# EAGLE design LPC_ERT_30_Thermostat_Adapter_smd1206 (EAGLE 5.07)
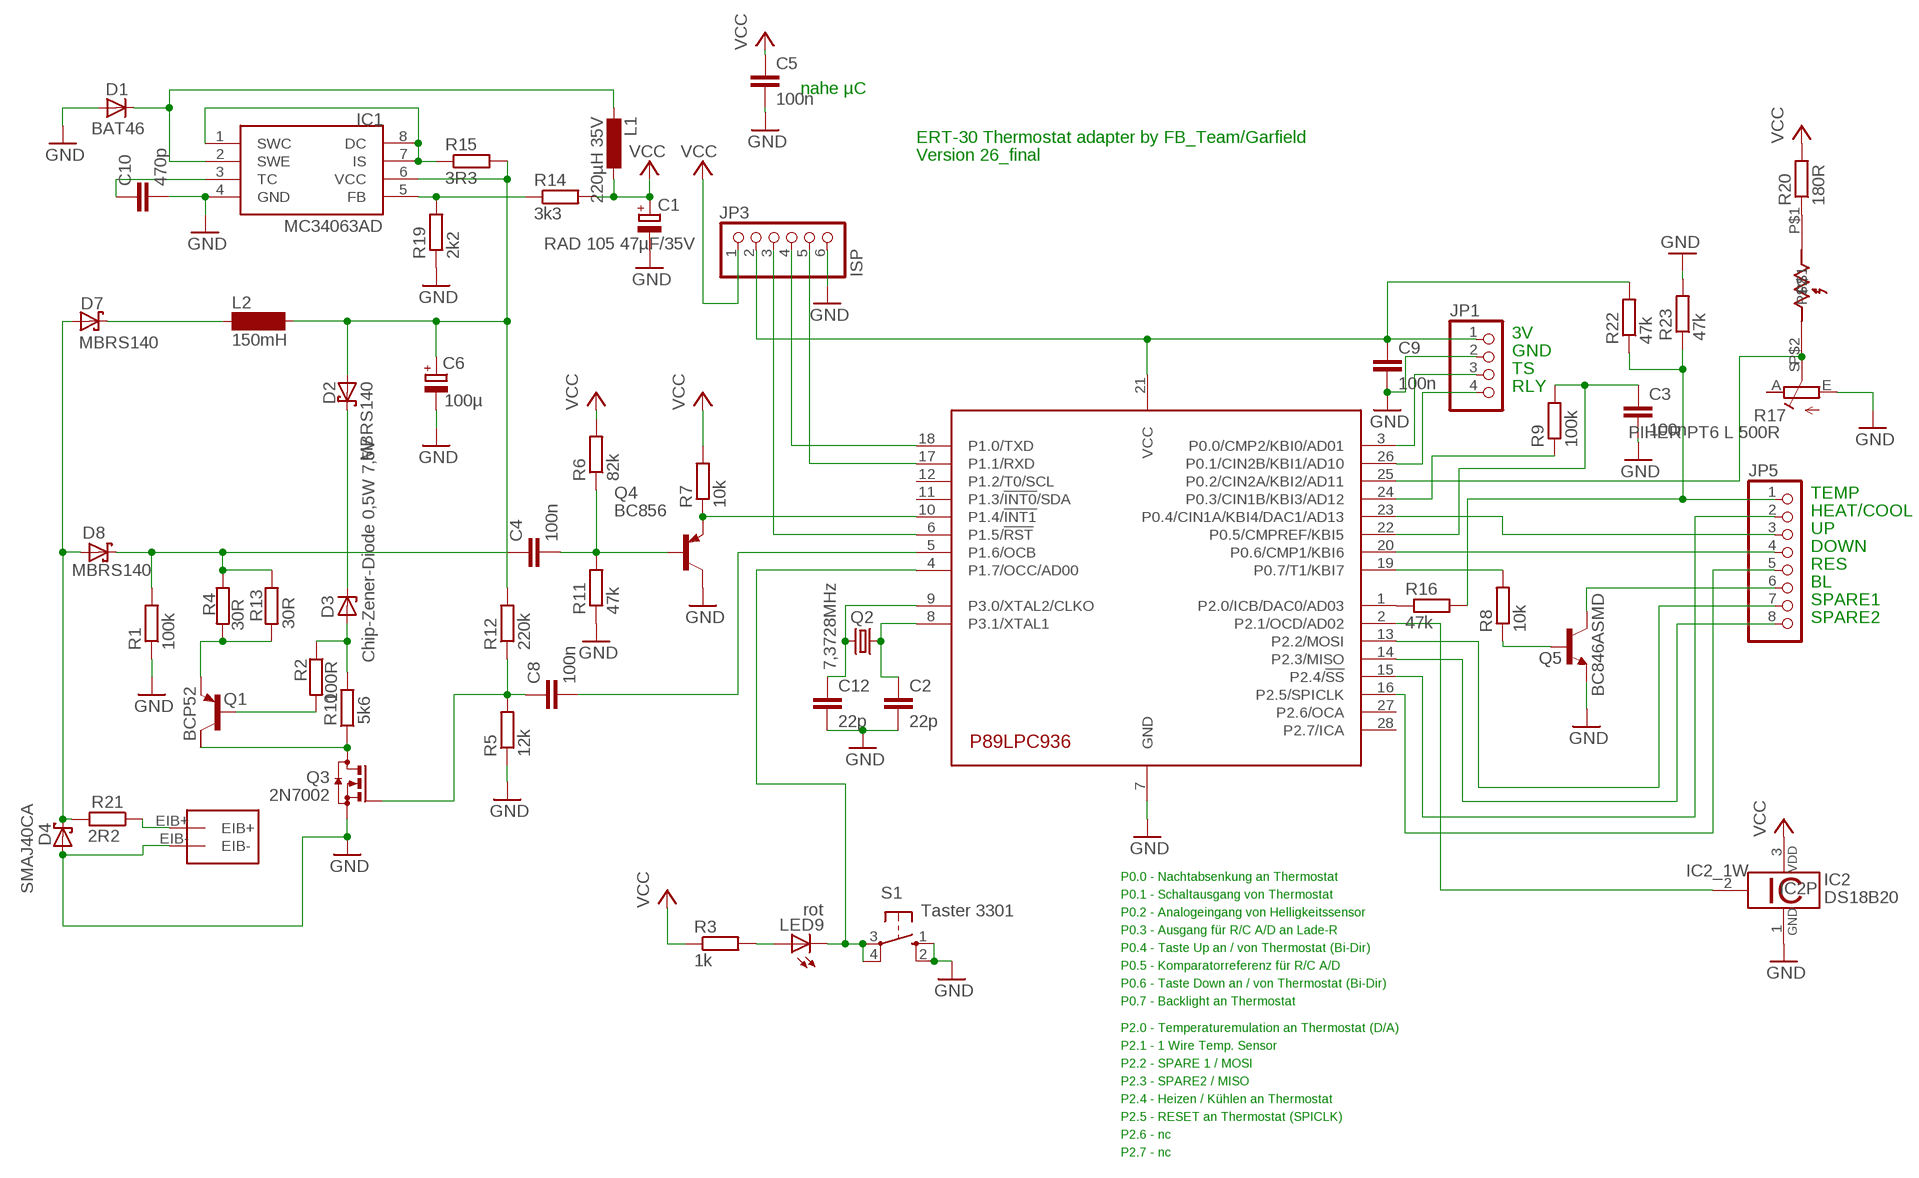
[diagram p0: schematic, sheet 1]

## Parts
C1  RAD 105 47µF/35V  CPOL-EUE2-5  [E2-5]
C2  22p  C-EUC1206  [C1206]
C3  100n  C-EUC1206  [C1206]
C4  100n  C-EUC1206  [C1206]
C5  100n  C-EUC1206  [C1206]
C6  100µ  CPOL-EUE2.5-7  [E2,5-7]
C8  100n  C-EUC1206  [C1206]
C9  100n  C-EUC1206  [C1206]
C10  470p  C-EUC1206  [C1206]
C12  22p  C-EUC1206  [C1206]
D1  BAT46  DIODE-MINIMELF  [MINIMELF]
D2  MBRS140  MBRS130LT3  [SMB]
D3  Chip-Zener-Diode 0,5W 7,5V  ZPD  [MINIMELF]
D4  SMAJ40CA  MBRS130LT3  [SMB]
D7  MBRS140  MBRS130LT3  [SMB]
D8  MBRS140  MBRS130LT3  [SMB]
IC1  MC34063AD  [SOIC8]
IC2  DS18B20  [TO92-]
JP1  PINHD-1X4  [1X04]
JP3  ISP  PINHD-1X6  [1X06]
JP5  PINHD-1X8  [1X08]
L1  220µH 35V  L-EU2200-11.43  [2200-11.43]
L2  150mH  SD12-1000  [SD12_1000]
LDR  LDR07  [LDR07]
LED9  rot  LEDCHIPLED_1206  [CHIPLED_1206]
Q1  BCP52  FZT753SMD  [SOT223]
Q2  7,3728MHz  CRYSTALHC49UP  [HC49UP]
Q3  2N7002  BSS123  [SOT23]
Q4  BC856  BC856ALT1SMD  [SOT23-BEC]
Q5  BC846ASMD  [SOT23]
R1  100k  R-EU_R1206  [R1206]
R2  100R  R-EU_R1206  [R1206]
R3  1k  R-EU_R1206  [R1206]
R4  30R  R-EU_R1206  [R1206]
R5  12k  R-EU_R1206  [R1206]
R6  82k  R-EU_R1206  [R1206]
R7  10k  R-EU_R1206  [R1206]
R8  10k  R-EU_R1206  [R1206]
R9  100k  R-EU_R1206  [R1206]
R10  5k6  R-EU_R1206  [R1206]
R11  47k  R-EU_R1206  [R1206]
R12  220k  R-EU_R1206  [R1206]
R13  30R  R-EU_R1206  [R1206]
R14  3k3  R-EU_R1206  [R1206]
R15  3R3  R-EU_R1206  [R1206]
R16  47k  R-EU_R1206  [R1206]
R17  PIHER PT6 L 500R  R-TRIMM-PT6L  [PT6L]
R19  2k2  R-EU_R1206  [R1206]
R20  180R  R-EU_R1206  [R1206]
R21  2R2  R-EU_R1206  [R1206]
R22  47k  R-EU_R1206  [R1206]
R23  47k  R-EU_R1206  [R1206]
S1  Taster 3301  10-XX  [B3F-10XX]
U$1  P89LPC936  P89LPC936_SMDPLCC28S  [PLCC28S]
U$5  EIB-CON  [EIB-CON]

## Nets
GND [supply]: C1.- C2.2 C3.2 C5.2 C6.- C9.2 C10.2 C12.2 D1.A D4.A IC1.4(GND) IC2.1 JP1.2 JP3.6 Q3.2(S) Q4.C Q5.2(E) R1.1 R5.1 R11.1 R17.E R19.1 R23.2 S1.1(S) S1.2(S1) U$1.7(GND) U$5.EIB-
N$1: Q4.E R7.1 U$1.10(P1.4/!INT1)
N$2: C4.2 Q4.B R6.1 R11.2
N$3: IC1.5(FB) R14.1 R19.2
N$4: IC1.1(SWC) IC1.7(IS) IC1.8(DC) R15.1
N$5: C8.2 U$1.5(P1.6/OCB)
N$6: Q1.2(C) Q3.3(D) R10.1
N$7 [supply]: C6.+ D2.A IC1.6(VCC) L2.2 R12.2 R15.2
N$8 [supply]: D7.C L2.1
N$9 [supply]: C4.1 D8.C R1.2 R4.1 R13.1
N$10: D1.C IC1.2(SWE) L1.2
N$11: D3.A R2.1 R10.2
N$12: Q1.3(E) R4.2 R13.2
N$13: C10.1 IC1.3(TC)
N$14: Q1.1(B) R2.2
N$15: C2.1 Q2.1 U$1.8(P3.1/XTAL1)
N$16 [supply]: D4.C D7.A D8.A R21.2
N$17: LED9.C S1.3(P) S1.4(P1) U$1.4(P1.7/OCC/AD00)
N$18: C12.1 Q2.2 U$1.9(P3.0/XTAL2/CLKO)
N$19: JP5.3 U$1.23(P0.4/CIN1A/KBI4/DAC1/AD13)
N$20: Q5.1(B) R8.1
N$21: R8.2 U$1.19(P0.7/T1/KBI7)
N$22: JP1.3 U$1.3(P0.0/CMP2/KBI0/AD01)
N$23: JP1.4 U$1.26(P0.1/CIN2B/KBI1/AD10)
N$24: JP5.6 Q5.3(C)
N$25: JP5.5 U$1.16(P2.5/SPICLK)
N$26: C3.1 R9.2 U$1.22(P0.5/CMPREF/KBI5)
N$27: JP5.2 U$1.15(P2.4/!SS)
N$29: JP3.4 U$1.18(P1.0/TXD)
N$30: JP3.5 U$1.17(P1.1/RXD)
N$31: JP3.3 U$1.6(P1.5/!RST)
N$32: LDR.P$1 R20.1
N$34: C8.1 Q3.1(G) R5.2 R12.1
N$35: C9.1 JP1.1 JP3.2 R22.2 U$1.21(VCC)
N$36: IC2.2 U$1.2(P2.1/OCD/AD02)
N$37: LDR.P$2 R17.S U$1.25(P0.2/CIN2A/KBI2/AD11)
N$38: JP5.7 U$1.13(P2.2/MOSI)
N$39: R21.1 U$5.EIB+
N$40: D2.C D3.C
N$41: LED9.A R3.2
N$44: JP5.8 U$1.14(P2.3/MISO)
N$46: JP5.1 R16.2 R22.1 R23.1
N$47: R16.1 U$1.1(P2.0/ICB/DAC0/AD03)
N$50: R9.1 U$1.24(P0.3/CIN1B/KBI3/AD12)
N$51: JP5.4 U$1.20(P0.6/CMP1/KBI6)
VCC [supply]: C1.+ C5.1 IC2.3 JP3.1 L1.1 R3.1 R6.2 R7.2 R14.2 R20.2
Unconnected: Q1.4(C/) R17.A U$1.11(P1.3/!INT0!/SDA) U$1.12(P1.2/T0/SCL) U$1.27(P2.6/OCA) U$1.28(P2.7/ICA)

## Notes on the sheet
- nahe µC
- ERT-30 Thermostat adapter by FB_Team/Garfield
- Version 26_final
- 3V
- GND
- TS
- RLY
- TEMP
- HEAT/COOL
- UP
- DOWN
- RES
- BL
- SPARE1
- SPARE2
- P0.0 - Nachtabsenkung an Thermostat
- P0.1 - Schaltausgang von Thermostat
- P0.2 - Analogeingang von Helligkeitssensor
- P0.3 - Ausgang für R/C A/D an Lade-R
- P0.4 - Taste Up an / von Thermostat (Bi-Dir)
- P0.5 - Komparatorreferenz für R/C A/D
- P0.6 - Taste Down an / von Thermostat (Bi-Dir)
- P0.7 - Backlight an Thermostat
- P2.0 - Temperaturemulation an Thermostat (D/A)
- P2.1 - 1 Wire Temp. Sensor
- P2.2 - SPARE 1 / MOSI
- P2.3 - SPARE2 / MISO
- P2.4 - Heizen / Kühlen an Thermostat
- P2.5 - RESET an Thermostat (SPICLK)
- P2.6 - nc
- P2.7 - nc

## Library data of the parts
C1 C6 = rcl:CPOL-EU: POLARIZED CAPACITOR, European symbol
C2-C5 C8-C10 C12 = rcl:C-EU: CAPACITOR, European symbol
D1 = diode:DIODE-: DIODE
D2 D4 D7 D8 = diode:MBRS130LT3: Schottky Power Rectifier Source: http://www.onsemi.com/pub/Collateral/MBRS130LT3-D.PDF
D3 = diode:ZPD: Z DIODE 500 mW
IC1 = mc34063:MC34063
IC2 = 1wire:DS18B20: Programmable Resolution Digital Thermometer This chip provides a onewire thermosensor with approx. 0.5°C accuracy. A programmable over/undertemperure alarm is available. The precision can be set from 9..12 bits. Notes: Vdd must be applied for accurate measurements at low temperatures, as the parasite power circuit otherwise heats the sensor. If parasite power is used, Vdd has to be connected to GND. The DS1822 is a low-cost thermometer chip, the DS18S20 is similar to the DS18B20, but with 9 Bit precision only. Author: Jan Kandziora <jjj@gmx.de>
JP1 = pinhead:PINHD-1X4: PIN HEADER
JP3 = pinhead:PINHD-1X6: PIN HEADER
JP5 = pinhead:PINHD-1X8: PIN HEADER
L1 = rcl:L-EU: INDUCTOR, European symbol
L2 = inductor-neosid:SD12: INDUCTOR nominal inductance
LDR = ldr:LDR07
LED9 = led:LED: LED OSRAM: - CHIPLED LG R971, LG N971, LY N971, LG Q971, LY Q971, LO R971, LY R971 LH N974, LH R974 LS Q976, LO Q976, LY Q976 LO Q996 - Hyper CHIPLED LW Q18S LB Q993, LB Q99A, LB R99A - SideLED LS A670, LO A670, LY A670, LG A670, LP A670 LB A673, LV A673, LT A673, LW A673 LH A674 LY A675 LS A676, LA A676, LO A676, LY A676, LW A676 LS A679, LY A679, LG A679 - Hyper Micro SIDELED® LS Y876, LA Y876, LO Y876, LY Y876 LT Y87S - SmartLED LW L88C, LW L88S LB L89C, LB L89S, LG L890 LS L89K, LO L89K, LY L89K LS L896, LA L896, LO L896, LY L896 - TOPLED LS T670, LO T670, LY T670, LG T670, LP T670 LSG T670, LSP T670, LSY T670, LOP T670, LYG T670 LG T671, LOG T671, LSG T671 LB T673, LV T673, LT T673, LW T673 LH T674 LS T676, LA T676, LO T676, LY T676, LB T676, LH T676, LSB T676, LW T676 LB T67C, LV T67C, LT T67C, LS T67K, LO T67K, LY T67K, LW E67C LS E67B, LA E67B, LO E67B, LY E67B, LB E67C, LV E67C, LT E67C LW T67C LS T679, LY T679, LG T679 LS T770, LO T770, LY T770, LG T770, LP T770 LB T773, LV T773, LT T773, LW T773 LH T774 LS E675, LA E675, LY E675, LS T675 LS T776, LA T776, LO T776, LY T776, LB T776 LHGB T686 LT T68C, LB T68C - Hyper Mini TOPLED® LB M676 - Mini TOPLED Santana® LG M470 LS M47K, LO M47K, LY M47K Source: http://www.osram.convergy.de LUXEON: - LUMILED® LXK2-PW12-R00, LXK2-PW12-S00, LXK2-PW14-U00, LXK2-PW14-V00 LXK2-PM12-R00, LXK2-PM12-S00, LXK2-PM14-U00 LXK2-PE12-Q00, LXK2-PE12-R00, LXK2-PE12-S00, LXK2-PE14-T00, LXK2-PE14-U00 LXK2-PB12-K00, LXK2-PB12-L00, LXK2-PB12-M00, LXK2-PB14-N00, LXK2-PB14-P00, LXK2-PB14-Q00 LXK2-PR12-L00, LXK2-PR12-M00, LXK2-PR14-Q00, LXK2-PR14-R00 LXK2-PD12-Q00, LXK2-PD12-R00, LXK2-PD12-S00 LXK2-PH12-R00, LXK2-PH12-S00 LXK2-PL12-P00, LXK2-PL12-Q00, LXK2-PL12-R00 Source: www.luxeon.com KINGBRIGHT: KA-3528ASYC Source: www.kingbright.com
Q1 = transistor-pnp:FZT753SMD: PNP Transistor
Q2 = crystal:CRYSTAL: CRYSTAL
Q3 = transistor-small-signal:BSS123: N-CHANNEL MOS FET
Q4 = transistor-pnp:BC856*: PNP Transistror
Q5 = transistor-npn:BC846*: NPN Transistor
R1-R3 R6-R10 R14-R16 R19-R23 = resistor:R-EU_: RESISTOR, European symbol
R4 R5 R11-R13 = rcl:R-EU_: RESISTOR, European symbol
R17 = kubi:R-TRIMM
S1 = switch-omron:10-XX: OMRON SWITCH
U$1 = micro-philips:P89LPC936_SMD
U$5 = EIBdevices:EIB-CON

## Board
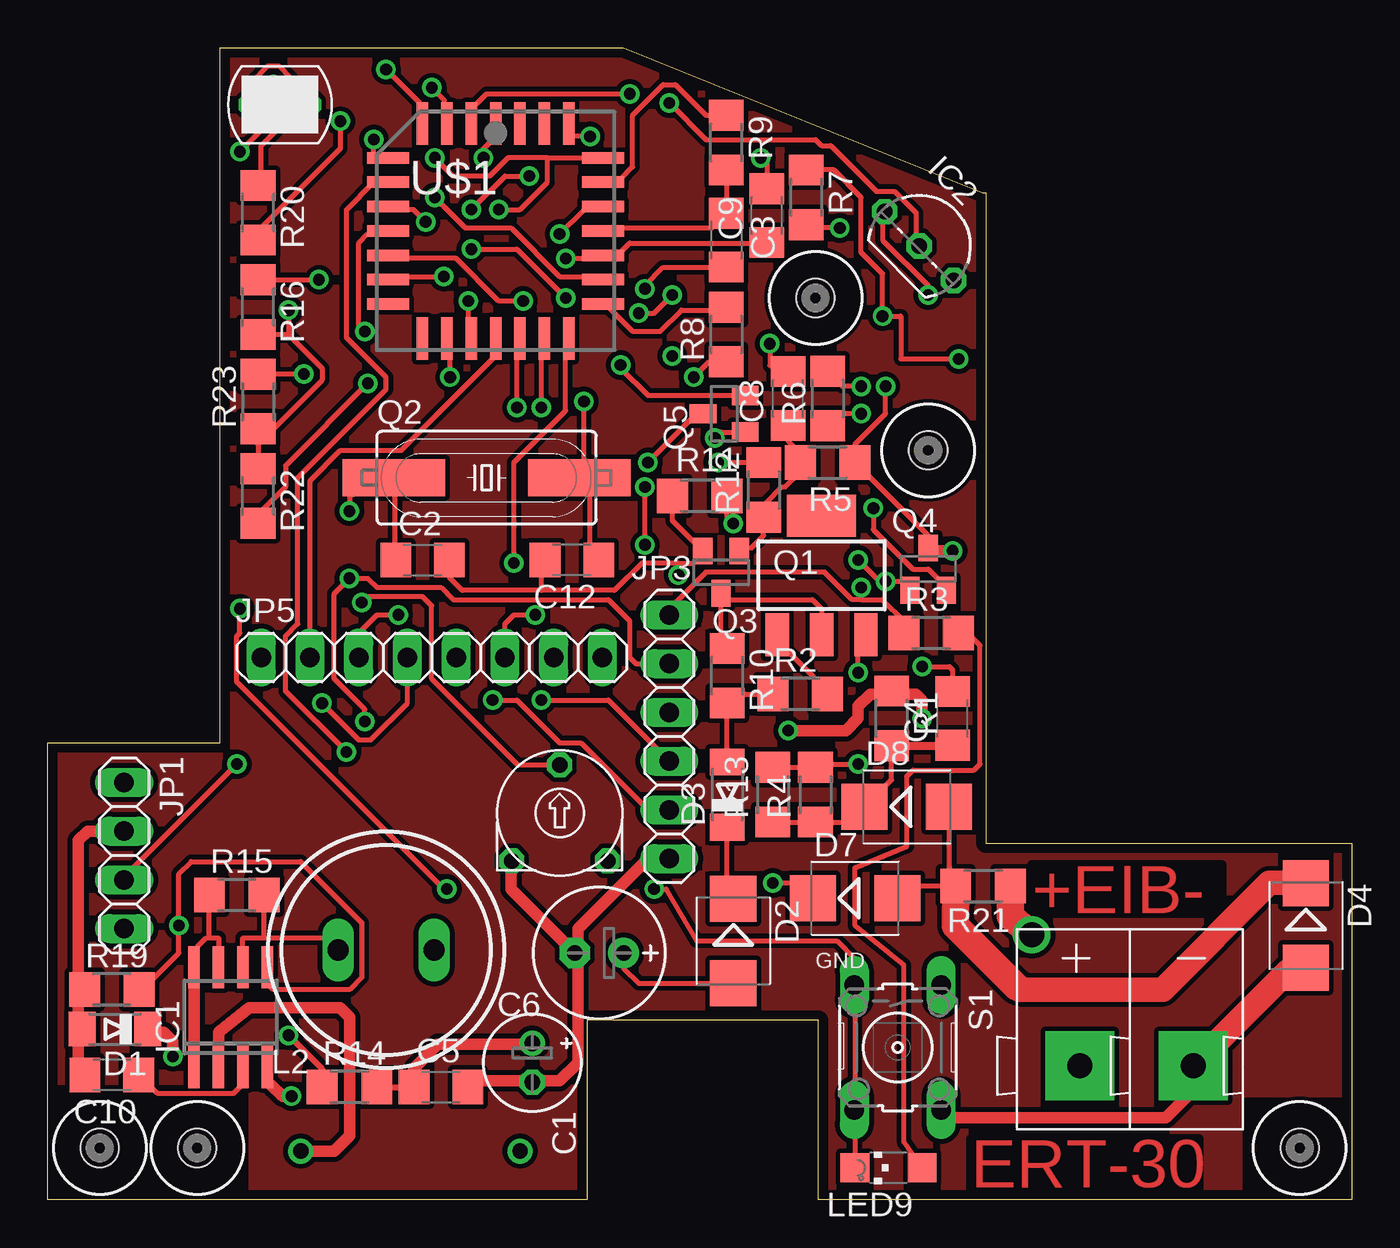
[diagram p1: board, top side]
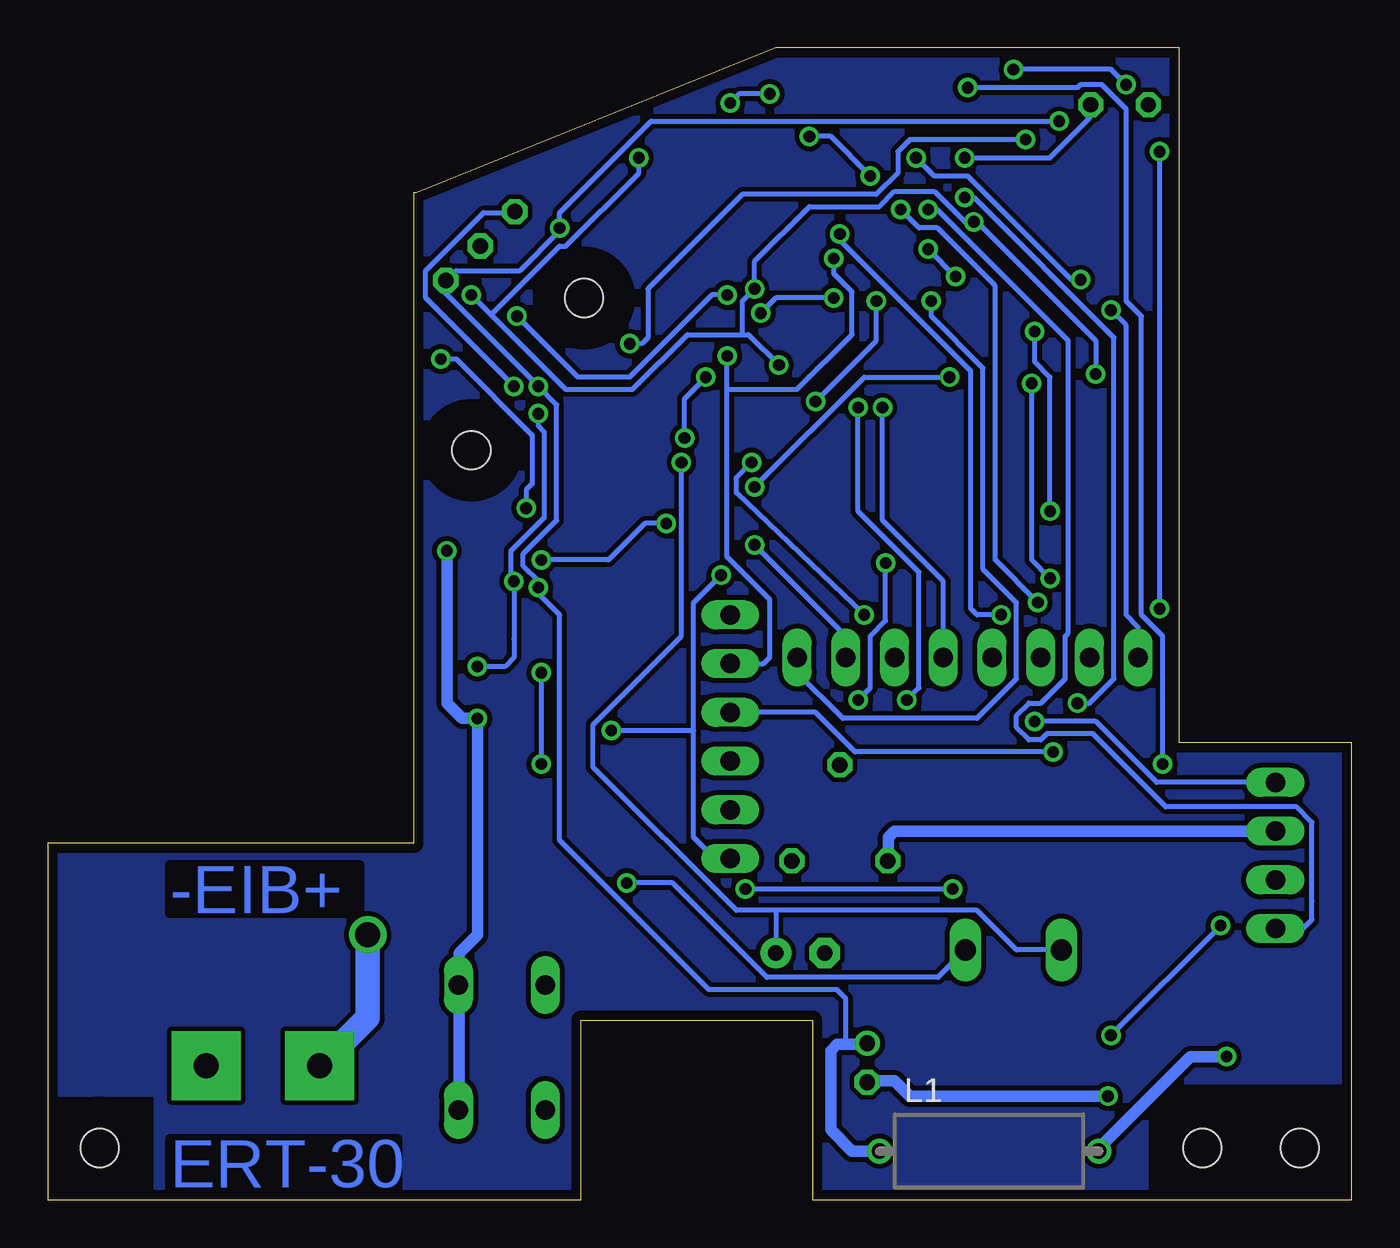
[diagram p2: board, bottom side, seen from below]

Size 67.94 x 60.02 mm. Coordinates in mm from the lower left corner, seen from the top.
Outline: 48.74,52.47 30,60.02 8.97,60.02 8.97,23.81 0,23.81 0,0 28.1,0 28.1,9.37 40.16,9.37 40.16,0 67.94,0 67.94,18.57 48.9,18.57 48.9,52.47 48.74,52.47
Outline: 48.74,52.47 48.74,52.47
Copper layers (1*16): Top 0.035mm / dielectric 1.5mm / Bottom 0.035mm
Design rules "Bilex DRU *": minimum track width 10mil, minimum drill 24mil, track to track 10mil, track to pad 10mil, pad to pad 10mil, via to via 10mil, smd to smd 10mil, copper to edge 20mil, drill to drill 8mil, minimum pad ring 10mil, minimum via ring 8mil, stop-mask expansion 4mil, vias tented up to drill 0mil, thermal gap 10mil

### Footprints (pad centres in the part's own frame; a part is rotated, then mirrored left to right if it is on the bottom)
E2-5 = drill 0.813 pad 1.27 round: + -1.016,0 | drill 0.813 pad 1.27 octagon: - 1.016,0
C1206 = smd 1.6 x 1.8: 1 -1.4,0; 2 1.4,0
E2,5-7 = drill 0.813 pad 1.6 round: + -1.27,0 | drill 0.813 pad 1.6 octagon: - 1.27,0
MINIMELF = smd 1.4 x 1.8: A 1.7,0; C -1.7,0
SMB = smd 2.4 x 2.4: A 2.2,0; C -2.2,0
SOIC8 = smd 0.6 x 2.2: 1 -1.905,-2.6; 2 -0.635,-2.6; 3 0.635,-2.6; 4 1.905,-2.6; 5 1.905,2.6; 6 0.635,2.6; 7 -0.635,2.6; 8 -1.905,2.6
TO92- = drill 0.813 octagon: 1 -2.54,0; 2 0,0; 3 2.54,0
1X04 = drill 1.016 long: 1 -3.81,0; 2 -1.27,0; 3 1.27,0; 4 3.81,0
1X06 = drill 1.016 long: 1 -6.35,0; 2 -3.81,0; 3 -1.27,0; 4 1.27,0; 5 3.81,0; 6 6.35,0
1X08 = drill 1.016 long: 1 -8.89,0; 2 -6.35,0; 3 -3.81,0; 4 -1.27,0; 5 1.27,0; 6 3.81,0; 7 6.35,0; 8 8.89,0
2200-11.43 = drill 0.8 pad 1.27 round: 1 -5.715,0; 2 5.715,0
SD12_1000 = drill 1.1 long: 1 -2.5,0; 2 2.5,0
LDR07 = drill 0.8 octagon: P$1 -1.5,0; P$2 1.5,0
CHIPLED_1206 = smd 1.5 x 1.5: A 0,-1.75; C 0,1.75
SOT223 = smd 1.219 x 2.235: 1 -2.311,-3.099; 2 0,-3.099; 3 2.311,-3.099 | smd 3.6 x 2.2: 4 0,3.099
HC49UP = smd 5.334 x 1.93: 1 -4.826,0; 2 4.826,0
SOT23 = smd 1 x 1.4: 1 -0.95,-1.1; 2 0.95,-1.1; 3 0,1.1
SOT23-BEC = smd 1 x 1.4: B -0.95,-1.1; C 0,1.1; E 0.95,-1.1
R1206 = smd 1.6 x 1.803: 1 -1.422,0; 2 1.422,0
PT6L = drill 0.8 octagon: A 2.5,2.5; E 2.5,-2.5; S -2.5,0
B3F-10XX = drill 1.016 long: 1 -3.251,2.261; 2 3.251,2.261; 3 -3.251,-2.261; 4 3.251,-2.261
PLCC28S = smd 0.6 x 2.2: 1 0,5.6; 2 -1.27,5.6; 3 -2.54,5.6; 4 -3.81,5.6; 12 -3.81,-5.6; 13 -2.54,-5.6; 14 -1.27,-5.6; 15 0,-5.6; 16 1.27,-5.6; 17 2.54,-5.6; 18 3.81,-5.6; 26 3.81,5.6; 27 2.54,5.6; 28 1.27,5.6 | smd 2.2 x 0.6: 5 -5.6,3.81; 6 -5.6,2.54; 7 -5.6,1.27; 8 -5.6,0; 9 -5.6,-1.27; 10 -5.6,-2.54; 11 -5.6,-3.81; 19 5.6,-3.81; 20 5.6,-2.54; 21 5.6,-1.27; 22 5.6,0; 23 5.6,1.27; 24 5.6,2.54; 25 5.6,3.81
DRIL-2 = hole 2: 0,0
EIB-CON = drill 1.3 pad 3.6 square: EIB+ -5.9,0; EIB- 0,0

### Placement (x,y rotation side)
C1  25.24,7.14 270 top
C2  19.53,33.34 0 top
C3  35.35,50.01 270 top
C4  47.15,25.08 90 top
C5  20.48,5.87 0 top
C6  28.73,12.86 180 top
C8  38.58,41.75 90 top
C9  37.47,51.28 90 top
C10  3.33,6.51 180 top
C12  27.3,33.34 180 top
D1  3.49,8.89 180 top
D2  35.72,13.49 270 top
D3  35.4,21.11 90 top
D4  65.56,14.29 270 top
D7  42.07,15.72 0 top
D8  44.77,20.48 0 top
IC1  9.53,9.53 0 top
IC2  45.4,49.69 315 top
JP1  3.97,17.94 270 top
JP3  32.38,24.13 270 top
JP5  20,28.26 0 top
L1  18.89,2.54 0 bottom
L2  17.62,13.02 180 top
LDR  12.09,57.06 0 top
LED9  43.81,1.67 90 top
Q1  40.32,32.54 0 top
Q2  22.86,37.62 0 top
Q3  35.08,32.7 180 top
Q4  45.88,32.86 0 top
Q5  35.24,40.96 90 top
R1  43.97,25.08 270 top
R2  39.21,26.35 0 top
R3  46.04,29.53 0 top
R4  40,21.11 90 top
R5  40.64,38.42 180 top
R6  40.64,41.75 90 top
R7  39.53,52.23 270 top
R8  35.35,45.09 90 top
R9  35.35,55.09 270 top
R10  35.4,27.3 270 top
R11  33.97,36.67 0 top
R12  37.31,36.99 90 top
R13  37.78,21.11 90 top
R14  15.72,5.87 0 top
R15  9.84,15.88 0 top
R16  10.95,46.51 270 top
R17  26.67,20.16 270 top
R19  3.33,10.95 0 top
R20  10.95,51.44 270 top
R21  48.74,16.35 180 top
R22  10.95,36.67 270 top
R23  10.95,41.59 90 top
S1  44.29,7.94 270 top
U$1  23.34,50.48 0 top
U$3  [DRIL-2]  45.88,39.05 0 top
U$4  [DRIL-2]  40.01,46.99 0 top
U$5  59.69,6.99 0 top
U$6  [DRIL-2]  2.7,2.7 0 top
U$7  [DRIL-2]  7.78,2.7 0 top
U$8  [DRIL-2]  65.25,2.7 0 top

### Tracks (layer width: path | path; a pad name or v marks a point on that pad's centre or on a via)
GND  (via drill 0.61)
  Top 0.254: 32.86,33.18 30.96,33.18 | 32.86,33.18 33.66,33.18 Q3.2 32.54,35.39 32.54,36.67 R11.1 | v32.86,32.54 32.86,33.18 | 11.59,6.03 IC1.4 | v19.68,50.96 19.05,51.59 18.73,51.59 U$1.7 | 46.2,33.81 Q4.C 45.88,34.6 R5.1 42.07,39.37 43.66,40.96 v43.66,42.39 | v45.88,47.15 45.88,47.62 43.5,50.01 43.5,51.44 43.56,51.44 IC2.1 | 30.96,33.18 | C12.2 25.72,33.63 25.72,31.75 | 30.96,33.18 29.53,31.75 25.72,31.75 | 25.72,31.75 21.59,31.75 20.95,32.38 20.95,33.34 C2.2 | v29.84,43.5 | Q5.2 36.2,41.91 31.27,41.91 29.84,43.34 v29.84,43.5 | C3.2 35.24,48.58 32.07,48.58 31.12,47.62 v31.12,47.47 | v37.15,54.29 37.46,53.98 37.46,52.7 C9.2 | v13.34,43.02 11.11,43.02 R23.2 | JP1.2
  Top 0.61: 11.59,6.03 12.22,5.4 v12.7,5.4 | 57.15,4.29 46.99,4.29 46.51,4.76 | v47.15,33.81 46.2,33.81 | v38.58,24.45 41.59,24.45 42.23,25.08 42.23,25.72 42.86,26.35 43.97,26.35 | R19.1 | R19.1 1.93,11.08 1.59,11.43 1.59,18.73 2.06,19.21 JP1.2 | R19.1 2.22,10.64 1.59,10.64 1.59,8.89 | 1.59,6.51 1.59,6.35 | C10.2 1.59,6.51 | 1.59,8.89 D1.A | 1.59,6.51 1.59,8.89 | 25.24,6.19 26.67,6.19 27.62,7.14 27.62,12.86 | 25.24,6.19 C1.- | C5.2 22.2,6.19 25.24,6.19 | C6.- | 24.13,17.62 | R17.E 24.13,17.62 | C6.- 24.13,16.19 24.13,17.62 | JP3.6 | JP3.6 | JP3.6 | JP3.6 31.27,17.78 27.62,14.13 27.62,12.86 | 27.62,12.86 C6.- | 43.97,26.35 43.97,26.48 R1.1 | 43.97,26.35 45.24,26.35 45.56,26.04 v45.56,25.08 | v45.56,25.08 | JP1.2 | 57.15,4.29 | 57.15,4.29 58.26,4.29 59.69,5.71 U$5.EIB- | U$5.EIB- | 46.51,4.76 46.51,4.72 S1.2 | 46.51,4.76
  Top 1.27: D4.A 65.56,11.91 64.61,11.91 U$5.EIB- | D4.A
  Bottom 0.254: v32.86,32.54 34.29,31.12 34.29,24.45 | v45.88,47.15 44.85,46.12 | 44.85,46.12 40.96,42.23 37.46,42.23 34.61,45.09 31.75,45.09 | 31.75,45.09 31.43,45.09 v29.84,43.5 | v29.84,43.5 | 31.75,45.09 31.75,46.83 v31.12,47.47 31.12,48.9 28.26,51.75 24.61,51.75 23.81,52.55 21.75,52.55 20.16,50.96 v19.68,50.96 19.53,50.96 13.34,44.77 v13.34,43.02 | v43.66,42.39 48.26,46.99 48.26,48.42 45.56,51.12 45.24,51.44 43.66,51.44 IC2.1 | 34.29,24.45 34.29,18.89 33.18,17.78 JP3.6 | JP3.6 | JP3.6 | v38.58,24.45 | 34.29,24.45 v38.58,24.45 | v37.15,54.29 37.15,53.5 40.96,49.69 41.27,49.69 44.77,46.2 44.85,46.12
  Bottom 0.61: v12.7,5.4 23.02,5.4 23.81,6.19 25.24,6.19 C1.- | v47.15,33.81 47.15,25.88 46.35,25.08 v45.56,25.08 45.56,13.81 46.51,12.86 46.51,11.23 S1.1 46.51,11.15 46.51,4.72 S1.2 | JP1.2 3.81,19.21 | JP1.2 | JP1.2 23.81,19.21 24.13,18.89 24.13,17.62 R17.E | R17.E
N$1  (via drill 0.61)
  Top 0.254: v43.02,36.04 43.02,34.92 45.09,32.86 45.88,32.86 46.35,32.38 Q4.E | v47.47,43.81 44.45,43.81 44.45,46.04 v43.5,46.04 43.5,48.26 42.39,49.37 42.39,52.23 40.96,53.66 R7.1 39.53,53.63 R7.1 | v20.64,48.1 18.73,48.1 U$1.10 | v22.07,49.53 24.45,49.53 v26.99,46.99 | v30.8,46.2 31.59,46.2 v32.54,47.15
  Bottom 0.254: v43.02,36.04 43.02,36.99 42.7,37.31 42.7,39.21 | v47.47,43.81 46.67,43.81 42.7,39.85 42.7,39.21 | v20.64,48.1 v22.07,49.53 | v26.99,46.99 30,46.99 v30.8,46.2 | v32.54,47.15 33.34,47.15 37.62,42.86 40.32,42.86 v43.5,46.04 | 42.7,39.21
N$2  (via drill 0.61)
  Top 0.254: Q4.B 44.45,32.23 v43.66,32.23 43.18,32.38 v42.23,33.34 | C4.2 47.15,27.62 46.99,27.78 v45.56,27.78 | R11.2 35.4,35.56 v35.72,35.24 | v42.39,40.96 | R6.1 41.25,40.96 v42.39,40.96
  Bottom 0.254: 43.66,29.21 v43.66,32.23 43.81,32.7 43.81,33.81 42.07,35.56 42.07,40.01 42.39,40.32 v42.39,40.96 | 43.66,29.21 | 43.66,29.21 43.66,28.26 44.13,27.78 v45.56,27.78 | v35.72,35.24 36.83,35.24 38.73,33.34 v42.23,33.34
N$3  (via drill 0.61)
  Top 0.254: IC1.5 11.59,11.11 11.75,10.95 15.72,10.95 16.35,11.59 16.35,14.45 13.18,17.62 7.46,17.62 6.83,16.99 v6.83,14.29 | R19.2 4.73,10.95 R19.2 | R19.2 | R19.2 4.92,11.11 | v6.83,14.29 | v6.83,14.29 6.83,12.86 4.92,10.95 R19.2 | v12.54,8.57
  Top 0.305: 14.61,6.51 14.61,5.71 R14.1 14.29,6.83 v12.54,8.57
  Bottom 0.254: v6.83,14.29 v12.54,8.57
N$4
  Top 0.254: IC1.7 8.89,13.18 8.89,13.65 8.41,13.65 | IC1.1 7.62,7.94 | 7.62,11.11 IC1.8 7.78,13.18 8.25,13.65 8.41,13.65 | R15.1 8.41,15.85 8.41,13.65
  Top 0.61: 7.62,7.94 7.62,11.11
N$5  (via drill 0.61)
  Top 0.254: v16.99,55.24 16.99,54.45 U$1.5 | v37.62,44.61 | C8.2 37.62,43.47 v37.62,44.61
  Bottom 0.254: v16.99,55.24 23.02,55.24 23.65,54.61 23.65,53.5 24.77,52.39 31.75,52.39 36.67,47.47 | v37.62,44.61 | v37.62,44.61 36.99,44.61 36.67,44.93 36.67,47.47 | 36.67,47.47
N$6
  Top 0.254: R10.1 35.08,29.37 Q3.3 35.56,31.27 39.85,31.27 40.32,30.8 40.32,30.32 Q1.2
N$7  (via drill 0.61)
  Top 0.254: IC1.6 10.16,13.18 10.16,13.65 11.27,13.65 | L2.2 14.45,13.65 11.27,13.65 | R15.2 11.27,15.85 11.27,13.65 | R12.2 v34.92,38.42 | D2.A 35.7,11.27 30.8,11.27 30,12.07 C6.+ | C6.+
  Bottom 0.254: v34.92,38.42 34.92,29.37 39.53,24.77 39.53,22.54 32.07,15.08 30,15.08 | 30,15.08 19.53,15.08 17.46,13.02 L2.2 | C6.+ | 30,15.08 C6.+
N$8  (via drill 0.61)
  Top 0.254: v37.78,16.51 38.73,16.51 D7.C
  Bottom 0.254: v37.78,16.51 35.4,16.51 30.48,11.59 21.55,11.59 L2.1
N$9
  Top 0.254: R13.1 38.58,19.69 39.21,19.69 R4.1 40.8,19.69 41.43,19.69 D8.C 43.97,21.89 43.97,23.68 R1.2
  Top 0.406: C4.1 47.15,23.65 44,23.65 R1.2
N$10  (via drill 0.61)
  Top 0.61: 10.48,10 8.89,8.73 IC1.2 | L1.2 13.49,2.54 | 10.48,10 | 10.48,10 15.24,10 15.72,9.53 15.72,3.33 14.92,2.54 L1.2 | L1.2 | L1.2 | v6.51,7.46 | v6.51,7.46 6.51,8.25 6.03,8.73 5.24,8.73 5.24,8.84 D1.C | L1.2 | L1.2
  Bottom 0.61: v6.51,7.46 8.41,7.46 13.18,2.7 L1.2
N$11
  Top 0.254: D3.A 35.4,23.5 35.4,25.24 R10.2 36.35,26.35 37.15,26.35 R2.1
N$12  (via drill 0.61)
  Top 0.254: R13.2 38.58,22.54 39.21,22.54 R4.2 40.8,22.7 v42.23,22.7 | v42.23,27.46 42.23,28.58 Q1.3
  Bottom 0.254: v42.23,22.7 v42.23,27.46
N$13
  Top 0.254: C10.1 5.69,5.56 9.68,5.56 10.16,6.03 IC1.3 | IC1.3
N$14
  Top 0.254: R2.2 39.85,27.3 38.58,28.58 Q1.1
N$15  (via drill 0.61)
  Top 0.254: v16.51,45.24 16.19,45.56 16.19,49.85 16.67,50.32 U$1.8 | v15.72,35.88 15.72,36.67 Q2.1 | Q2.1 18.1,37.62 18.1,34.16 C2.1 | Q2.1
  Bottom 0.254: v16.51,45.24 16.51,43.66 15.72,42.86 v15.72,35.88
N$16
  Top 0.254: D7.A 45.4,16.35 46.67,16.35 R21.2 46.99,17.3 46.99,19.37 D8.A
  Top 1.27: 50.48,11.11 50.64,10.95 58.1,10.95 63.66,16.51 65.56,16.51 D4.C | D4.C
  Top 1.422: 50.48,11.11 47.31,14.29 R21.2
N$17  (via drill 0.61)
  Top 0.254: v31.59,16.19 32.23,16.19 33.81,13.49 39.53,13.49 | LED9.C 42.07,1.59 | LED9.C | 39.53,13.49 | 39.53,13.49 41.12,13.49 42.07,12.54 42.07,11.15 | 42.07,4.65 LED9.C | 42.07,4.65 S1.4 | 42.07,11.15 S1.3 | 42.07,11.15 42.07,4.65 | v17.62,58.9 19.37,57.15 U$1.4 | v11.75,58.1 11.75,56.36 v10,54.61 | v10,30.8 10,29.53 9.84,29.37 9.84,26.99 20.64,16.19 v20.8,16.19
  Bottom 0.254: v20.8,16.19 v31.59,16.19 | v17.62,58.9 12.54,58.9 v11.75,58.1 | v10,30.8 v10,54.61
N$18  (via drill 0.61)
  Top 0.254: v24.77,46.83 23.5,46.83 21.27,49.05 18.73,49.05 U$1.9 | v27.94,41.59 27.94,38.58 Q2.2 | C12.1 28.26,33.94 28.26,37.47 28.1,37.62 Q2.2 | Q2.2 27.62,37.62 | Q2.2
  Bottom 0.254: v24.77,46.83 24.77,44.77 v27.94,41.59
N$19  (via drill 0.61)
  Top 0.254: v26.67,50.32 27.94,51.59 U$1.23 | JP5.3 16.19,29.53 17.14,30.48 v18.26,30.48
  Bottom 0.254: v26.67,50.32 26.67,50.01 19.84,43.18 19.84,32.23 | 19.84,32.23 | 19.84,32.23 19.84,30.8 19.53,30.48 v18.26,30.48
N$20  (via drill 0.61)
  Top 0.254: v34.77,39.69 35.08,40.01 36.2,40.01 Q5.1 | 35.24,43.97 R8.1 35.24,43.66 34.45,43.66 v33.66,42.86
  Bottom 0.254: v34.77,39.69 34.77,41.75 v33.66,42.86
N$21
  Top 0.254: R8.2 35.24,46.67 | R8.2 35.24,46.51 | R8.2 35.24,46.36 33.02,46.36 31.91,45.24 30.48,45.24 29.05,46.67 U$1.19
N$22  (via drill 0.61)
  Top 0.254: v20,57.94 20.64,57.31 20.64,56.2 U$1.3 | v9.84,22.7 3.97,16.83 JP1.3
  Bottom 0.254: v20,57.94 14.29,57.94 14.13,58.1 13.02,58.1 11.75,56.83 11.75,46.83 10.95,46.04 10.95,30.48 9.84,29.37 v9.84,22.7
N$23  (via drill 0.61)
  Top 0.254: v28.26,55.4 27.3,55.4 U$1.26 | v25.08,53.34 23.81,53.34 v22.07,51.59
  Bottom 0.254: v28.26,55.4 27.15,55.4 v25.08,53.34 | v22.07,51.59 21.59,51.59 14.76,44.77 14.76,29.53 14.92,29.37 14.92,27.15 16.19,25.88 16.83,25.88 17.46,25.24 17.46,24.61 16.83,23.97 16.19,23.97 15.88,24.29 13.49,24.29 9.68,20.48 2.86,20.48 2.06,19.69 2.06,15.56 2.06,14.61 2.54,14.13 JP1.4 | JP1.4
N$24  (via drill 0.61)
  Top 0.254: JP5.6 23.81,30 24.29,30.48 v25.4,30.48 | v31.27,38.42 33.66,40.8 34.13,40.8 Q5.3 | v31.27,38.42
  Bottom 0.254: v31.27,38.42 32.07,37.62 32.07,36.83 v25.4,30.48
N$25  (via drill 0.61)
  Top 0.254: v24.45,41.27 24.45,43.81 U$1.16
  Bottom 0.254: v24.45,41.27 24.45,35.4 21.27,32.23 JP5.5
N$26
  Top 0.254: R9.2 35.4,53.66 35.4,51.44 C3.1 35.24,51.28 34.61,50.64 29.05,50.64 U$1.22
N$27
  Top 0.254: U$1.15 23.18,43.81 18.41,39.05 15.24,39.05 13.65,37.47 JP5.2
N$28
  pour Bottom: 27.78,0.32 27.78,9.53 40.64,9.53 40.64,9.21 40.64,0.16 62.23,0.16 62.23,0.63 62.23,5.56 67.63,5.56 67.63,6.51 67.63,18.26 48.58,18.26 48.58,52.23 30,59.69 9.21,59.69 9.21,23.5 0.16,23.5 0.16,6.19 10.79,6.19 10.79,0.16 27.94,0.16 27.94,0.32
  pour Top: 27.62,0.32 27.62,9.53 40.48,9.53 40.48,9.21 40.48,0.16 62.07,0.16 62.07,0.63 62.07,5.56 67.47,5.56 67.47,6.51 67.47,18.26 48.42,18.26 48.42,52.23 29.85,59.69 9.05,59.69 9.05,23.5 0,23.5 0,6.19 10.64,6.19 10.64,0.16 27.78,0.16 27.78,0.32
N$29  (via drill 0.61)
  Top 0.254: v24.29,33.18 24.29,38.42 26.99,41.12 26.99,43.81 U$1.18 | JP3.4 29.21,26.04 v25.72,26.04
  Bottom 0.254: v24.29,33.18 24.29,30.16 25.08,29.37 25.08,26.67 v25.72,26.04
N$30  (via drill 0.61)
  Top 0.254: v25.72,41.27 25.72,43.81 U$1.17 | v23.18,26.04 24.45,26.04 26.67,23.81 27.78,23.81 31.27,20.32 JP3.5 | JP3.5 | JP3.5
  Bottom 0.254: v25.72,41.27 25.72,35.88 22.54,32.7 22.54,26.67 v23.18,26.04
N$31  (via drill 0.61)
  Top 0.254: v15.56,23.34 12.38,26.51 12.38,29.37 13.02,30 13.02,37.62 17.62,42.23 17.62,42.86 15.56,44.93 15.56,51.59 16.99,53.02 17.62,53.02 U$1.6
  Bottom 0.254: v15.56,23.34 25.88,23.34 27.62,25.08 27.94,25.4 JP3.3 | JP3.3 | JP3.3
N$32
  Top 0.254: R20.1 11.11,52.86 11.11,54.93 12.54,56.36 12.54,57.63 12.7,57.78 12.7,58.42 12.07,59.06 11.43,59.06 10.64,58.26 10.64,57.15 LDR.P$1
N$34
  Top 0.254: Q3.1 36.2,33.97 36.67,33.97 37.31,34.61 R12.1 37.46,35.72 37.46,36.35 38.26,37.15 38.42,37.15 39.21,37.94 39.21,38.26 R5.2 39.21,38.89 38.58,39.53 38.58,40.32 C8.1
N$35  (via drill 0.61)
  Top 0.254: v26.99,49.05 27.94,49.05 U$1.21 29.05,49.37 29.84,49.37 30.32,49.85 37.46,49.85 C9.1 | v16.51,24.92 16.51,25.56 14.92,27.15 14.92,31.59 v15.72,32.38 | v15.72,32.38 | v15.72,32.38 16.67,32.38 17.14,31.91 20.48,31.91 21.11,31.27 29.21,31.27 30.32,30.16 30.32,28.26 30.64,27.94 JP3.2 | JP3.2 | JP3.2 | R22.2 11.11,35.4 11.11,35.88 12.38,37.15 12.38,38.26 v16.67,42.55
  Bottom 0.254: v26.99,49.05 26.99,48.26 26.04,47.31 26.04,45.09 28.89,42.23 32.54,42.23 | v16.51,24.92 13.34,24.92 10.16,21.75 JP1.1 | v15.72,32.38 | v16.67,42.55 16.67,33.34 v15.72,32.38 | v32.54,43.97 | 32.54,42.23 v32.54,43.97 | JP3.2 | JP3.2 | JP3.2 30.64,27.94 30.32,28.26 30.32,29.53 30.32,31.27 32.23,33.18 32.54,33.5 32.54,42.23 | JP1.1
N$36  (via drill 0.61)
  Top 0.254: v30.32,57.63 22.86,57.63 22.07,56.83 22.07,56.2 U$1.2 | v32.38,57.15 34.29,55.24 40.01,55.24 40.32,54.93 40.8,54.93 43.18,52.55 44.13,52.55 45.24,51.44 45.24,49.85 IC2.2
  Bottom 0.254: v30.32,57.63 31.91,57.63 v32.38,57.15
N$37  (via drill 0.61)
  Top 0.254: 26.04,54.29 23.97,54.29 23.02,53.34 21.11,53.34 v20.16,54.29 | 26.04,54.29 27.94,54.29 U$1.25 | v23.5,51.59 24.61,51.59 26.04,53.02 26.04,54.29 | R17.S 24.49,22.66 20,27.15 20,30.96 19.53,31.43 16.67,31.43 v16.35,31.12 | v16.35,31.12
  Bottom 0.254: v20.16,54.29 15.72,54.29 | 15.72,54.29 | v23.5,51.59 22.54,50.64 21.59,50.64 18.57,47.62 18.57,33.34 v16.35,31.12 | v16.35,31.12 | 15.72,54.29 13.65,56.36 13.65,56.99 LDR.P$2
N$38  (via drill 0.61)
  Top 0.254: v20.95,42.86 20.95,43.81 U$1.13 | v31.12,34.13 v31.12,37.15
  Bottom 0.254: v20.95,42.86 25.4,42.86 v31.12,37.15 | JP5.7 26.35,29.37 v31.12,34.13
N$39  (via drill 1.3)
  Top 1.422: v51.28,13.81 50.16,14.76 R21.1
  Bottom 1.27: v51.28,13.81 | U$5.EIB+ 51.28,9.5 v51.28,13.81
N$40
  Top 0.254: D3.C 35.4,18.73 35.4,16.83 D2.C
N$41
  Top 0.254: LED9.A 44.61,3.02 44.61,12.22 42.07,14.29 42.07,17.3 44.77,18.41 44.77,22.07 45.09,22.38 48.26,22.38 48.58,22.7 48.58,28.89 47.94,29.53 R3.2
N$44  (via drill 0.61)
  Top 0.254: v21.91,46.83 21.91,45.88 U$1.14
  Bottom 0.254: v21.91,46.83 21.91,46.04 19.21,43.34 19.21,32.86 17.46,31.12 17.46,27.15 19.53,25.08 26.51,25.08 28.89,27.46 JP5.8
N$46  (via drill 0.61)
  Top 0.254: JP5.1 | 10.95,39.37 R23.1 | 10.95,39.37 R22.1 | 12.54,45.09 11.11,45.09 R16.2 | 12.54,45.09 14.29,43.34 14.29,42.7 10.95,39.37 | v12.54,46.36 12.54,45.09
  Bottom 0.254: v12.54,46.36 11.75,45.56 11.75,30.48 11.11,29.84 JP5.1
N$47  (via drill 0.61)
  Top 0.254: v14.13,47.94 11.11,47.94 R16.1 | v22.7,54.29 22.7,54.77 23.18,55.24 23.18,56.04 U$1.1
  Bottom 0.254: v14.13,47.94 14.61,47.94 20,53.34 21.75,53.34 v22.7,54.29
N$50
  Top 0.254: R9.1 35.24,56.52 34.29,56.52 32.7,58.1 32.07,58.1 30.48,56.52 30.48,53.82 29.84,53.18 29.05,53.18 U$1.24
N$51  (via drill 0.61)
  Top 0.254: v20.16,52.23 21.75,50.64 24.13,50.64 26.67,48.1 27.94,48.1 U$1.20 | v14.29,25.88 16.19,23.97 16.83,23.97 18.73,25.88 JP5.4
  Bottom 0.254: v20.16,52.23 19.68,52.23 12.38,44.93 12.38,27.15 13.65,25.88 v14.29,25.88
VCC  (via drill 0.61)
  Top 0.254: 42.39,31.27 41.91,31.27 40.48,32.7 34.29,32.7 32.38,30.8 JP3.1 | 42.39,31.27 43.5,31.27 44.61,30.16 R3.1 | v42.39,31.91 42.39,31.27 | v42.39,42.39 | R6.2 41.41,42.39 v42.39,42.39 | v41.27,50.64 | R7.2 39.72,50.64 v41.27,50.64 | JP3.1 | JP3.1 | R20.2 11.11,50.16 11.11,50.64 15.24,54.77 v15.24,56.2
  Top 0.305: C5.1 | R14.2 C5.1
  Top 0.61: C5.1 19.05,5.9 19.05,6.83 20.32,8.1 25.24,8.1 C1.+
  Bottom 0.254: 26.35,8.1 26.35,10.48 26.83,10.95 33.5,10.95 41.27,18.73 41.27,30.48 42.23,31.43 v42.39,31.91 42.39,32.23 43.18,33.02 43.18,33.66 41.43,35.4 41.43,41.43 v42.39,42.39 47.31,47.31 IC2.3 46.67,48.42 43.34,48.42 41.27,50.48 v41.27,50.64 | v15.24,56.2 36.51,56.2 41.27,51.44 v41.27,50.64 | v41.27,50.64
  Bottom 0.61: L1.1 | L1.1 26.04,2.54 27.15,3.65 27.15,7.78 26.83,8.1 26.35,8.1 25.18,8.1 | 25.18,8.1 25.08,8.1 | C1.+ 25.18,8.1

### Text on the board
Top: +EIB- | ERT-30
Bottom: -EIB+ | ERT-30
tPlace: GND